# Altium schematic sheet MCU.SchDoc
size A4; SheetNumber: 2; SheetTotal: 2
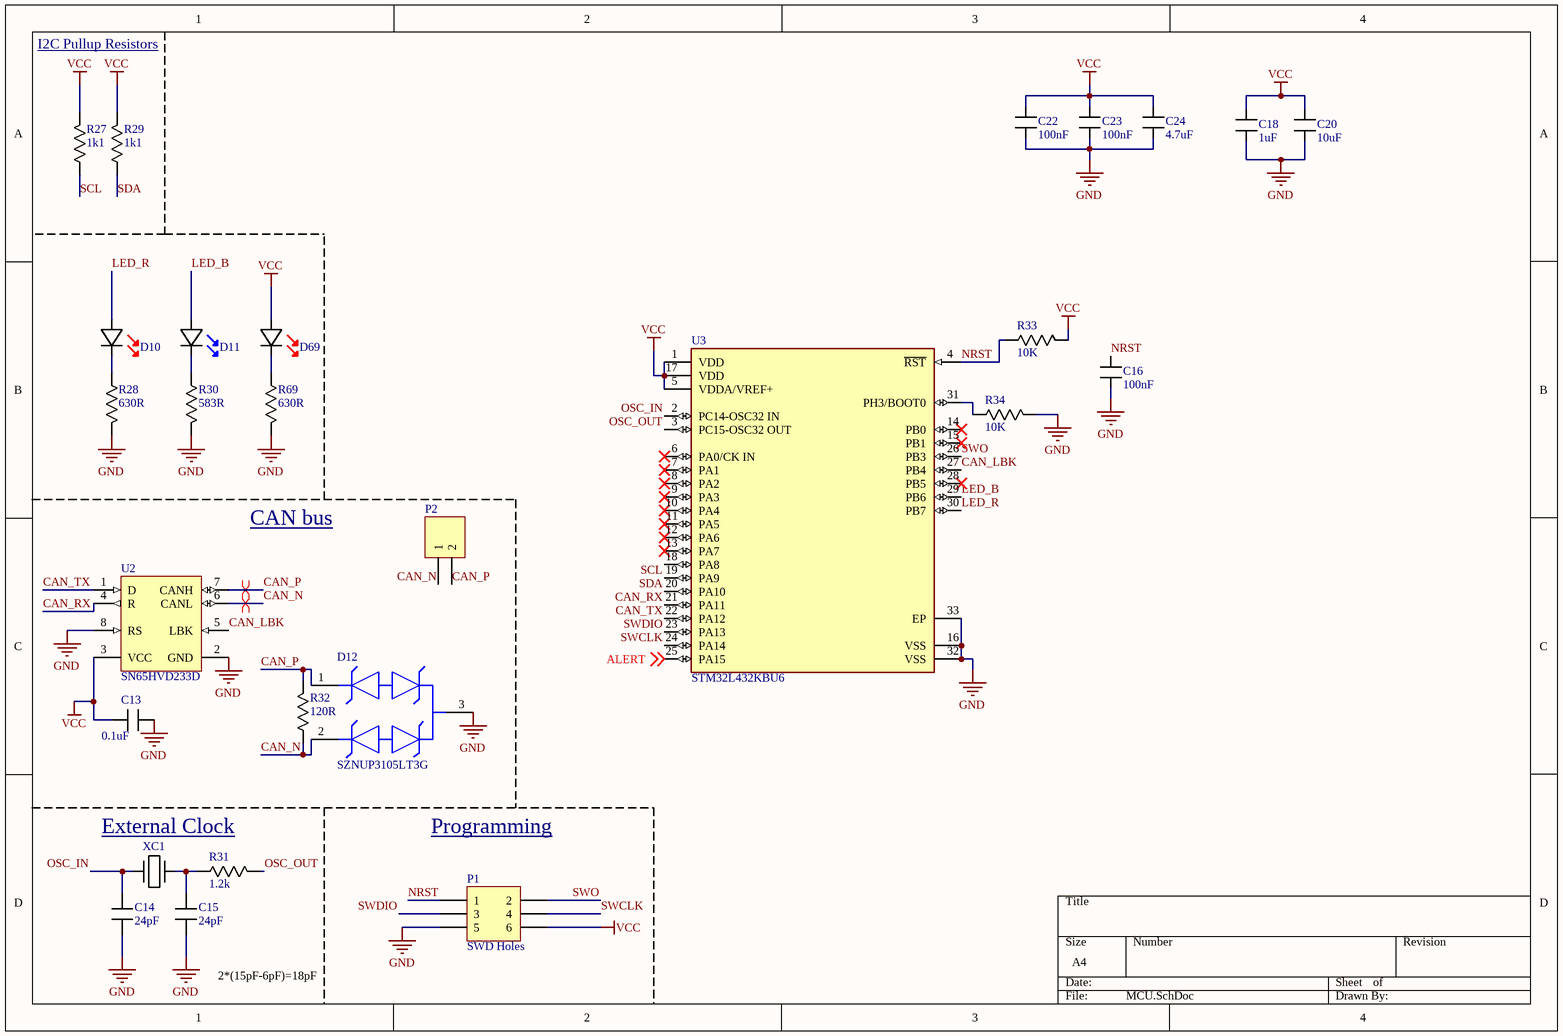
[diagram p0: MCU.SchDoc]

## Parts
C13  value 0.1uF  [C_0603]  (hidden comment: 06035C104JAT4A)
C14  value 24pF  [C_0603]  (hidden comment: 06031U240FAT2A)
C15  value 24pF  [C_0603]  (hidden comment: 06031U240FAT2A)
C16  value 100nF  [C_0603]  (hidden comment: C0603X104K5RAC7411)
C18  value 1uF  [C_0603]  (hidden comment: C0603C105K9RAC7411)
C20  value 10uF  [C_0603]  (hidden comment: JMK107ABJ106KAHT)
C22  value 100nF  [C_0603]  (hidden comment: C0603X104K5RAC7411)
C23  value 100nF  [C_0603]  (hidden comment: C0603X104K5RAC7411)
C24  value 4.7uF  [C_0603]  (hidden comment: JMK107BB7475KA-T)
D10  150060RS55040  [150060xS55040]  (value not drawn)
D11  150060BS55040  [150060xS55040]  (value not drawn)
D12  SZNUP3105LT3G  [FP-318-08-MFG]
D69  150060RS55040  [150060xS55040]  (value not drawn)
P1  SWD Holes  [2*3 2.54mm header]
P2  Nothing  [2x1 2.54MM PITCH]  (value not drawn)
R27  value 1k1  [R-0603]  (hidden comment: CRCW06031K10JNEAC)
R28  value 630R  [R-0603]  (hidden comment: RT0603DRE07583RL)
R29  value 1k1  [R-0603]  (hidden comment: CRCW06031K10JNEAC)
R30  value 583R  [R-0603]  (hidden comment: RT0603DRE07583RL)
R31  value 1.2k  [R-0603]  (hidden comment: Resistor)
R32  value 120R  [R-0603]  (hidden comment: Dont populate)
R33  value 10K  [R-0603]  (hidden comment: CMP0603AFX-1002ELF)
R34  value 10K  [R-0603]  (hidden comment: CMP0603AFX-1002ELF)
R69  value 630R  [R-0603]  (hidden comment: RT0603DRE07583RL)
U2  SN65HVD233D  [D0008A_N]
U3  STM32L432KBU6  [FP-UFQFPN32-A0B8-MFG]
XC1  ATS600BSM-1E  [ATS600BSM-1E]  (value not drawn)

## Nets
GND: C13.1 C14.1 C15.1 C16.1 C18.1 C20.1 C22.1 C23.1 C24.1 D12.3 P1.5 R28.2 R30.2 R34.2 R69.2 U2.2(GND) U2.8(RS) U3.16(VSS) U3.32(VSS) U3.33(EP)
VCC: C13.2 C18.2 C20.2 C22.2 C23.2 C24.2 D69.2(Anode) P1.6 R27.2 R29.2 R33.2 U2.3(VCC) U3.1(VDD) U3.5(VDDA/VREF+) U3.17(VDD)
ALERT: U3.25(PA15) ; off-sheet ALERT
CAN_LBK: U2.5(LBK) U3.27(PB4)
CAN_N: D12.2 P2.1 R32.1 U2.6(CANL)
CAN_P: D12.1 P2.2 R32.2 U2.7(CANH)
CAN_RX: U2.4(R) U3.21(PA11)
CAN_TX: U2.1(D) U3.22(PA12)
LED_B: D11.2(Anode) U3.29(PB6)
LED_R: D10.2(Anode) U3.30(PB7)
NRST: C16.2 P1.1 R33.1 U3.4(~{RST})
OSC_IN: C14.2 U3.2(PC14-OSC32_IN) XC1.1
OSC_OUT: R31.2 U3.3(PC15-OSC32_OUT)
SCL: R27.1 U3.19(PA9)
SDA: R29.1 U3.20(PA10)
SWCLK: P1.4 U3.24(PA14)
SWDIO: P1.3 U3.23(PA13)
SWO: P1.2 U3.26(PB3)
NetC15_2: C15.2 R31.1 XC1.1
NetD10_1: D10.1(Cathode) R28.1
NetD11_1: D11.1(Cathode) R30.1
NetD69_1: D69.1(Cathode) R69.1
NetR34_1: R34.1 U3.31(PH3/BOOT0)

Not connected (* = marked no-connect by the designer): U3 6(PA0/CK_IN)* 7(PA1)* 8(PA2)* 9(PA3)* 10(PA4)* 11(PA5)* 12(PA6)* 13(PA7)* 14(PB0)* 15(PB1)* 18(PA8) 28(PB5)*

## Layout directives
differential pair: CAN_N, CAN_P

## Notes on the sheet
- I2C Pullup Resistors
- CAN bus
- External Clock
- Programming
- (near C15) 2*(15pF-6pF)=18pF

## Library data of the parts
C13 = Capacitor: Manufacturer: Kyocera AVX; ComponentLink1Description: New link; ComponentLink1URL: *; Supplier 1: Mouser; Supplier Part Number 1: 581-06035C104JAT4A; Manufacturer Part Number: 06035C104JAT4A; RoHS: Yes; Category: Ceramic Capacitors; Stock 1: 26326; Pricing 1: 1=0.11000, 10=0.04300, 50=0.04300, 100=0.03500, 1000=0.02000, 10000=0.01400 (USD); RoHS Compliant: Yes
C14 C15 = Capacitor: Cap Ceramic 24pF 100V C0G 1% Pad SMD 0603 125°C Ultra Low ESR T/R; Manufacturer: Kyocera AVX; Temperature Coefficient: 30ppm/°C; ComponentLink1Description: New link; ComponentLink1URL: *; Supplier 1: Mouser; Supplier Part Number 1: 581-06031U240FAT2A; Manufacturer Part Number: 06031U240FAT2A; RoHS: Yes; Category: Ceramic Capacitors; Stock 1: 95996; Pricing 1: 1=0.41000, 10=0.28400, 50=0.28400, 100=0.16900, 1000=0.10700, 10000=0.07900 (USD); Mount: Surface Mount; Case/Package: 0603; Case Code (Metric): 1608; Case Code (Imperial): 0603; Weight: 7.1E-05oz; Min Operating Temperature: -55°C; Max Operating Temperature: 125°C; Capacitance: 24pF; Voltage Rating: 100V; Tolerance: 1%; Package Quantity: 4000; Packaging: Tape and Reel; Voltage Rating (DC): 100V; Dielectric: C0G; Termination: SMD/SMT; Resistor Type: Ceramic; Series: U; Construction: Flat; Length: 1.52mm; Width: 0.03inch; Thickness: 0.036inch; Depth: 0.76mm; Radiation Hardening: No; Lead Free: Lead Free; RoHS Compliant: Yes; ComponentLink2URL: https://datasheet.ciiva.com/208/useries-208498.pdf?src-supplier=Digi-Key; ComponentLink2Description: https://datasheet.ciiva.com/208/useries-208498.pdf?src-supplier=Digi-Key; ComponentLink3URL: https://datasheet.ciiva.com/11568/useries-11568149.pdf?src-supplier=Avnet; ComponentLink3Description: https://datasheet.ciiva.com/11568/useries-11568149.pdf?src-supplier=Avnet
C16 C22 C23 = Capacitor: CAP CER 0.1UF 50V X7R 0603; Manufacturer: KEMET; Dielectric Material: Ceramic; Tolerance: 10%; Supplier 1: RSComponents; Supplier Part Number 1: 2053261; Manufacturer Part Number: C0603X104K5RAC7411; RoHS: Yes; Category: Ceramic Capacitors; Stock 1: 28600; Pricing 1: 15000=0.02900, 45000=0.02700 (USD); Mount: Surface Mount; Case/Package: 0603; Case Code (Metric): 1608; Case Code (Imperial): 0603; Min Operating Temperature: -55°C; Max Operating Temperature: 125°C; Capacitance: 100nF; Voltage Rating: 50V; Package Quantity: 1; Packaging: Cut Tape; Voltage Rating (DC): 50V; Features: Soft Termination; Length: 0.064inch; Width: 0.032inch; Thickness: 0.034inch; RoHS Compliant: Yes; ComponentLink1URL: https://api.kemet.com/component-edge/download/datasheet/C0603X104K5RAC7411.pdf?src-supplier=Digi-Key; ComponentLink1Description: https://api.kemet.com/component-edge/download/datasheet/C0603X104K5RAC7411.pdf?src-supplier=Digi-Key; ComponentLink2URL: http://www.farnell.com/datasheets/2747793.pdf?src-supplier=Newark; ComponentLink2Description: http://www.farnell.com/datasheets/2747793.pdf?src-supplier=Newark
C18 = Capacitor: Manufacturer: KEMET; Supplier 1: Mouser; Supplier Part Number 1: 80-C0603C105K9R7411; Manufacturer Part Number: C0603C105K9RAC7411; RoHS: Yes; Stock 1: 22716; Pricing 1: 1=0.25000, 10=0.10200, 50=0.10200, 100=0.08700, 1000=0.05300, 10000=0.04400 (USD); RoHS Compliant: Yes
C20 = Capacitor: 0603, 6.3V, X5R, 10 uF ± 10 %, T&R Q200 multilayer ceramic capacitor; Manufacturer: Taiyo Yuden; Supplier 1: Mouser; Supplier Part Number 1: 963-JMK107ABJ106KAHT; Manufacturer Part Number: JMK107ABJ106KAHT; RoHS: Yes; Category: Ceramic Capacitors; Stock 1: 12080; Pricing 1: 1=0.30000, 10=0.10600, 50=0.10600, 100=0.07200, 1000=0.04800, 10000=0.03500 (USD); RoHS Compliant: Yes
C24 = Capacitor: Cap Ceramic 4.7uF 6.3V X7R 10% Pad SMD 0603 125°C T/R; Manufacturer: Taiyo Yuden; Supplier 1: Mouser; Supplier Part Number 1: 963-JMK107BB7475KA-T; Manufacturer Part Number: JMK107BB7475KA-T; RoHS: Yes; Category: Ceramic Capacitors; Stock 1: 75256; Pricing 1: 1=0.30000, 10=0.16700, 50=0.16700, 100=0.12200, 1000=0.10700, 10000=0.10100 (USD); Mount: Surface Mount; Case/Package: 0603; Case Code (Imperial): 0603; Case Code (Metric): 1608; Min Operating Temperature: -55°C; Max Operating Temperature: 125°C; Packaging: Cut Tape; Capacitance: 4.7uF; Tolerance: 10%; Voltage Rating: 6.3V; Lead Free: Lead Free; RoHS Compliant: Yes; ComponentLink1URL: http://www.farnell.com/datasheets/2801343.pdf?src-supplier=Farnell; ComponentLink1Description: http://www.farnell.com/datasheets/2801343.pdf?src-supplier=Farnell; ComponentLink2URL: http://ds.yuden.co.jp/TYCOMPAS/ut/detail.do?productNo=JMK107BB7475KA-T&fileName=JMK107BB7475KA-T_SS&mode=specSheetDownload&src-supplier=Digi-Key; ComponentLink2Description: http://ds.yuden.co.jp/TYCOMPAS/ut/detail.do?productNo=JMK107BB7475KA-T&fileName=JMK107BB7475KA-T_SS&mode=specSheetDownload&src-supplier=Digi-Key; ComponentLink3URL: https://ds.yuden.co.jp/TYCOMPAS/ut/detail?pn=JMK107BB7475KA-T &u=M&src-supplier=Digi-Key; ComponentLink3Description: https://ds.yuden.co.jp/TYCOMPAS/ut/detail?pn=JMK107BB7475KA-T &u=M&src-supplier=Digi-Key; ComponentLink4URL: http://www.farnell.com/datasheets/2801343.pdf?src-supplier=Element14; ComponentLink4Description: http://www.farnell.com/datasheets/2801343.pdf?src-supplier=Element14; ComponentLink5URL: http://www.farnell.com/datasheets/2801343.pdf?src-supplier=Newark; ComponentLink5Description: http://www.farnell.com/datasheets/2801343.pdf?src-supplier=Newark
D10 D69 = 150060RS55040: SMT Mono-color Chip LED Diffused
D11 = 150060BS55040: LED BLUE DIFFUSED 0603 SMD; Manufacturer: Wurth Electronics; Lens Style: Flat; Luminous Intensity: 80mcd; Forward Voltage: 3.2V; Test Current: 20mA; Viewing Angle: 140°; Dominant Wavelength: 470nm; Lens Size: 0.8mm; Supplier 1: Mouser; Manufacturer Part Number: 150060BS55040; RoHS: No; Pricing 1: 1=0.18000, 10=0.16200, 50=0.13200, 100=0.11700, 1000=0.08800, 10000=0.08800 (USD); Mount: Surface Mount; Case/Package: 0603; Color: Blue; Packaging: Tape and Reel; Lens Transparency: Diffused; Length: 1.6mm; Width: 0.8mm; Height: 0.5mm; RoHS Compliant: No; ComponentLink1URL: http://www.farnell.com/datasheets/2621640.pdf?src-supplier=Farnell; ComponentLink1Description: http://www.farnell.com/datasheets/2621640.pdf?src-supplier=Farnell; ComponentLink2URL: https://www.we-online.de/web/en/index.php/download/media/07_electronic_components/download_center_1/application_notes_berichte/ano002_leds___the_future_of_horticultural_lighting/ANO002b_EN_LEDs_The_Future_of_Horticultural_Lighting.pdf?src-supplier=Digi-Key; ComponentLink2Description: https://www.we-online.de/web/en/index.php/download/media/07_electronic_components/download_center_1/application_notes_berichte/ano002_leds___the_future_of_horticultural_lighting/ANO002b_EN_LEDs_The_Future_of_Horticultural_Lighting.pdf?src-supplier=Digi-Key; ComponentLink3URL: https://katalog.we-online.de/pbs/datasheet/150060BS55040.pdf?src-supplier=Digi-Key; ComponentLink3Description: https://katalog.we-online.de/pbs/datasheet/150060BS55040.pdf?src-supplier=Digi-Key; Supplier Part Number 1: 710-150060BS55040
D12 = CMP-07200-000005-1: TVS DIODE 32V 66V SOT23-3; Manufacturer: ON Semiconductor; Capacitance: 30pF; Max Junction Temp: +150°C; Standoff Height: 0.01mm; Peak Pulse Power: 350W; Breakdown Voltage: 35.6V; Automotive Grade: Grade 0; Number Of Channels: 2; Value: 30pF; Direction: Bidirectional; Peak Pulse Current: 8A; Height: 1.11mm; Mouser Description: 32V Dual Line CAN Bus Protector in SOT-23 AEC-Q 24 V CAN Bus Protector in SOT-23; Device Class L3: unset; Clamping Voltage: 66V; Manufacturer Part Number: SZNUP3105LT3G; ComponentLink2Description: Datasheet; Octopart: https://octopart.com/sznup3105lt3g-on+semiconductor-54318507; Temperature Range High: +150°C; Reverse Standoff Voltage: 32V; RoHS: TRUE; Package: 318-08; Device Class L2: TVS Diodes; Device Class L1: Circuit Protection; Temperature Range Low: -55°C; Lead Free: Yes; Temperature: -55°C to +150°C; ComponentLink2URL: https://www.onsemi.com/pub/Collateral/NUP3105L-D.PDF; Automotive: Yes; Footprint Url: https://www.onsemi.com/pub/Collateral/318-08.PDF; Digikey Description: TVS DIODE 32V 66V SOT23-3; Category: Diode
P1 = MHDR2X3: Header, 3-Pin, Dual row; LatestRevisionDate: 17-Jul-2002; LatestRevisionNote: Re-released for DXP Platform.; Publisher: Altium Limited
P2 = MHDR1X2: Header, 2-Pin; LatestRevisionDate: 17-Jul-2002; LatestRevisionNote: Re-released for DXP Platform.; Publisher: Altium Limited
R27 R29 = Resistor: Manufacturer: Vishay; Supplier 1: Mouser; Supplier Part Number 1: 71-CRCW06031K10JNEAC; Manufacturer Part Number: CRCW06031K10JNEAC; RoHS: Yes; Category: Chip SMD Resistors; Stock 1: 51915; Pricing 1: 1=0.10000, 10=0.03000, 50=0.03000, 100=0.01200, 1000=0.00500, 10000=0.00300 (USD); RoHS Compliant: Yes
R28 R69 = Resistor: High Precision-High Stability Chip Resistor Thin Film 0603 583Ohm 0.5% Paper T/R; Manufacturer: Yageo; Max Power Dissipation: 100mW; Temperature Coefficient: 50ppm/°C; Resistance: 583R; Supplier 1: Mouser; Supplier Part Number 1: 603-RT0603DRE07583RL; Manufacturer Part Number: RT0603DRE07583RL; RoHS: Yes; Category: Chip SMD Resistors; Stock 1: 17347; Pricing 1: 1=0.14000, 10=0.07400, 50=0.07400, 100=0.02600, 1000=0.01900, 10000=0.01200 (USD); Case/Package: 0603; Min Operating Temperature: -55°C; Max Operating Temperature: 155°C; Resistor Type: Thin Film; Packaging: Tape and Reel; Number of Terminations: 2; Tolerance: 0.5%; ComponentLink1URL: http://www.yageo.com/documents/recent/PYu-RT_1-to-0.01_RoHS_L_9.pdf?src-supplier=Digi-Key; ComponentLink1Description: http://www.yageo.com/documents/recent/PYu-RT_1-to-0.01_RoHS_L_9.pdf?src-supplier=Digi-Key
R30 = Resistor: High Precision-High Stability Chip Resistor Thin Film 0603 583Ohm 0.5% Paper T/R; Manufacturer: Yageo; Max Power Dissipation: 100mW; Temperature Coefficient: 50ppm/°C; Supplier 1: Mouser; Supplier Part Number 1: 603-RT0603DRE07583RL; Manufacturer Part Number: RT0603DRE07583RL; RoHS: Yes; Category: Chip SMD Resistors; Stock 1: 17347; Pricing 1: 1=0.14000, 10=0.07400, 50=0.07400, 100=0.02600, 1000=0.01900, 10000=0.01200 (USD); Case/Package: 0603; Min Operating Temperature: -55°C; Max Operating Temperature: 155°C; Resistor Type: Thin Film; Packaging: Tape and Reel; Number of Terminations: 2; Resistance: 583R; Tolerance: 0.5%; ComponentLink1URL: http://www.yageo.com/documents/recent/PYu-RT_1-to-0.01_RoHS_L_9.pdf?src-supplier=Digi-Key; ComponentLink1Description: http://www.yageo.com/documents/recent/PYu-RT_1-to-0.01_RoHS_L_9.pdf?src-supplier=Digi-Key
R32 = Resistor: Bus termination resistor
R33 R34 = Resistor: Manufacturer: Bourns; Supplier 1: Mouser; Supplier Part Number 1: 652-CMP0603AFX-1002L; Manufacturer Part Number: CMP0603AFX-1002ELF; RoHS: No; Stock 1: 10216; Pricing 1: 1=0.21000, 10=0.09200, 50=0.09200, 100=0.05300, 1000=0.02900, 10000=0.02200 (USD)
U2 = CMP-0315-00036-2: 3.3V CAN Transceiver with Standby Mode, Loop-back, 6 mA, -40 to 125 degC, 8-pin SOIC (D), Green (RoHS & no Sb/Br); Manufacturer: Texas Instruments; Receivers Per Package: 1; Bus Fault Voltage(V): +/-30; Rating: Catalog; ICC(Max)(mA): 6; Supply Voltage(s)(V): 3.3; Transient Pulse Protection(V): -100 to 100; PackageVersion: revM, Jun-2011; PackageReference: D0008A; ComponentLink1Description: Datasheet; Isolated: No; Footprint: PCA82C250, excludes pin5; DatasheetVersion: SLLS557F; PackageDescription: 8-Pin Plastic Small Outline Integrated Circuit, 4.9 x 3.9 mm, Pitch 1.27 mm Pitch; Features: Loop Back; Low Power Mode: Standby; SubFamily: CAN; Drivers Per Package: 1; Eco-Plan: Green (RoHS & no Sb/Br); ComponentLink1URL: http://www.ti.com/general/docs/lit/getliterature.tsp?genericPartNumber=SN65HVD233&fileType=pdf; PartNumber: SN65HVD233D; Code_JEDEC: MS-012AA; Mounting Technology: Surface Mount
U3 = CMP-12105-000014-1: IC MCU 32BIT 128KB FLASH 32QFPN; Manufacturer: STMicroelectronics; Memory Size: 128KBytes; Number Of I/Os: 26; Max Supply Voltage: 3.6V; Core Architecture: ARM Cortex-M4; Number Of A/D Converters: 1; Number Of Timers/Counters: 8; Min Supply Voltage: 1.62V; Interface: I2C,SPI,UART,USART,USB,IrDA; Number Of Spi Channels: 2; Frequency: 80MHz; Max Junction Temp: +105°C; Number Of Adc Channels: 10; Ram Size: 64KBytes; Data Bus Width: 32bits; Ambient Temperature Range High: +85°C; Device Class L2: Embedded Processors and Controllers; Temperature: -40°C to +85°C; Category: IC; ComponentLink2URL: https://www.st.com/resource/en/datasheet/stm32l432kb.pdf; Device Class L1: Integrated Circuits (ICs); ComponentLink2Description: Datasheet; Memory Type: FLASH; Ipc Land Pattern Name: QFN50P500X500X55-32; Temperature Range Low: -40°C; Height: 0.6mm; Digikey Description: IC MCU 32BIT 128KB FLASH 32QFPN; Temperature Range High: +85°C; Device Class L3: Microcontrollers; Lead Free: Yes; RoHS: TRUE; Octopart: https://octopart.com/stm32l432kbu6-stmicroelectronics-74568735; Manufacturer Part Number: STM32L432KBU6; Number Of Uart Channels: 1; Ambient Temperature Range Low: -40°C; Package: UFQFPN32-A0B8; Number Of I2C Channels: 2; Number Of Cores: 1; Automotive: No
XC1 = ATS600BSM-1E: CRYSTAL 60.0000MHZ 18PF SMD; Manufacturer: CTS; Frequency: 60MHz; Tolerance: 30ppm; ESR (Equivalent Series Resistance): 80R; Frequency Stability: 50ppm; Supplier 1: Mouser; Manufacturer Part Number: ATS600BSM-1E; RoHS: Yes; Category: Crystals; Stock 1: 862; Pricing 1: 1=0.44000, 10=0.34000, 50=0.34000, 100=0.30200, 1000=0.23000, 10000=0.20200 (USD); Mount: Surface Mount; Number of Pins: 2; Contact Plating: Copper,Tin,Silver; Min Operating Temperature: -40°C; Max Operating Temperature: 85°C; Packaging: Tape and Reel; Load Capacitance: 18pF; Package Quantity: 1000; Frequency Tolerance: 30ppm; Termination: SMD/SMT; Series: ATS-SM; Length: 0.437inch; Width: 3.8mm; Height: 0.169inch; RoHS Compliant: Yes; ComponentLink1URL: https://datasheet.ciiva.com/861/008-0309-0-861343.pdf?src-supplier=Digi-Key; ComponentLink1Description: https://datasheet.ciiva.com/861/008-0309-0-861343.pdf?src-supplier=Digi-Key; ComponentLink2URL: https://datasheet.ciiva.com/3176/008-0309-0-3176665.pdf?src-supplier=Avnet; ComponentLink2Description: https://datasheet.ciiva.com/3176/008-0309-0-3176665.pdf?src-supplier=Avnet; ComponentLink3URL: https://datasheet.ciiva.com/4949/008-0309-0-32667-4949738.pdf?src-supplier=Mouser; ComponentLink3Description: https://datasheet.ciiva.com/4949/008-0309-0-32667-4949738.pdf?src-supplier=Mouser; Supplier Part Number 1: 774-ATS600BSM-1E